# Altium project SNES TST.PrjPcb
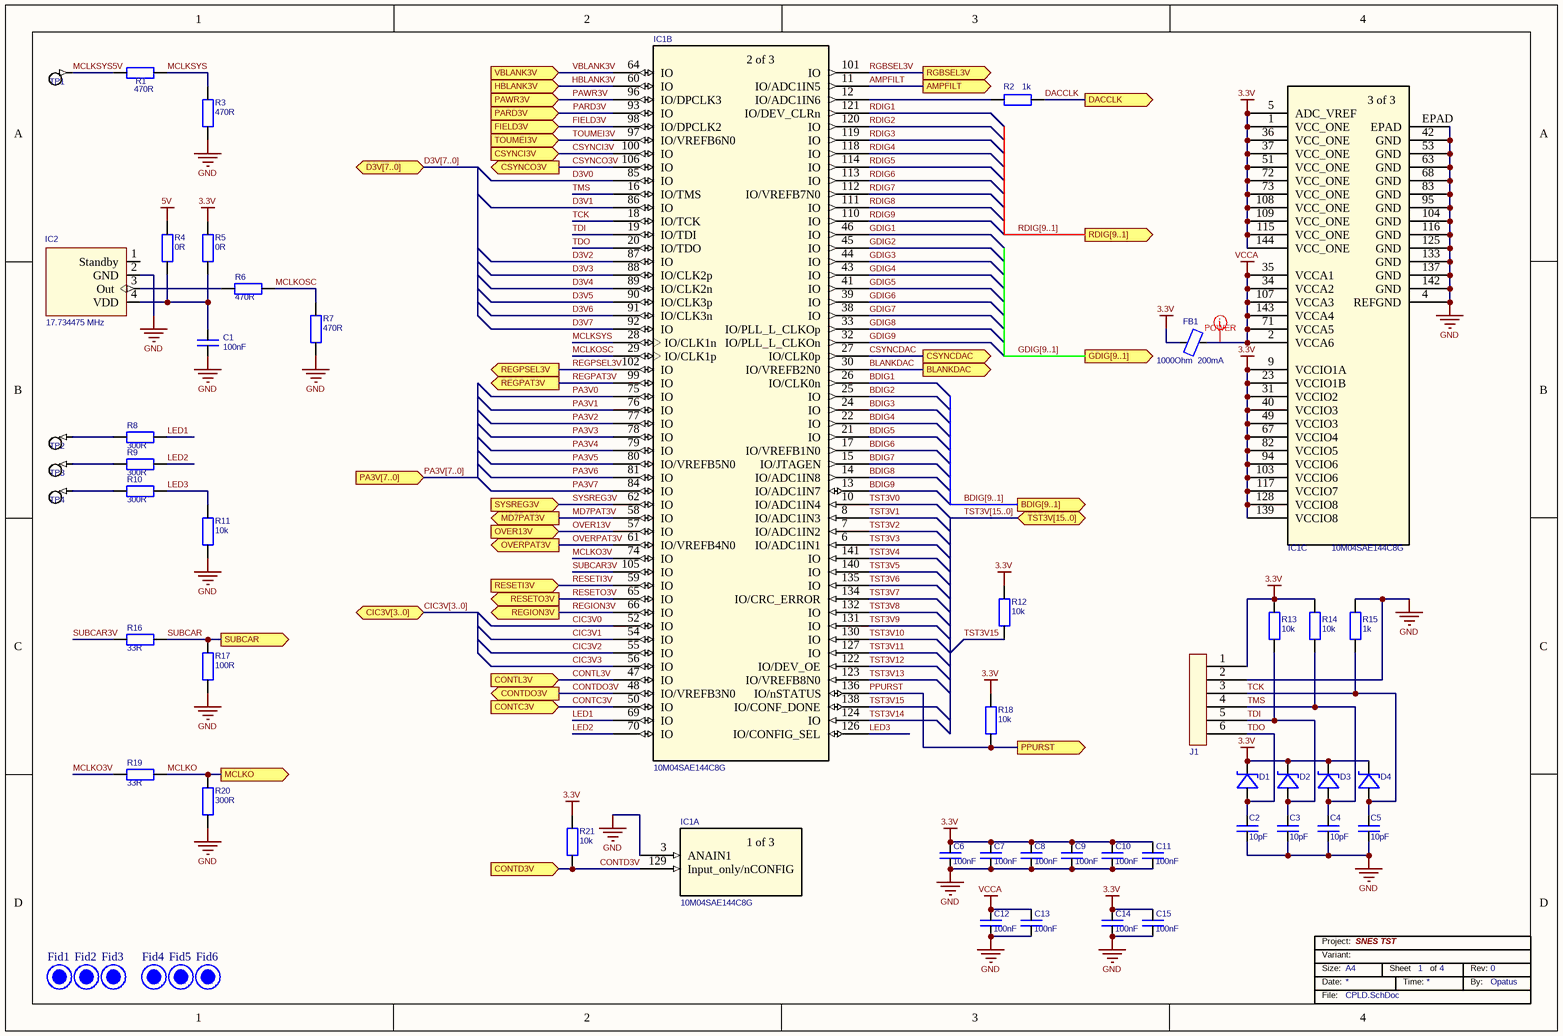
[diagram p0: CPLD.SchDoc]
Revision: Rev 0
4 sheets, 189 parts. Net scope: flat (ports and power ports of the same name join across sheets).
Board file: SNES TST.PcbDoc
Sheets:
  CPLD.SchDoc
  PPU2 And Connector.SchDoc
  Power And Voltage Shifters.SchDoc
  RGB Video Output.SchDoc

## Sheet CPLD.SchDoc: SNES TST
size A4; DrawnBy: Opatus; DocumentNumber: 1; Revision: 0; SheetNumber: 1; SheetTotal: 4

### Parts
C1  value 100nF  [Cap_0402_Chip]  (hidden comment: Ceramic Capacitor 100nF 10V ±20% X7R 0402)
C2  value 10pF  [Cap_0402_Chip]  (hidden comment: Ceramic Capacitor 10pF 10V ±20% X7R 0402)
C3  value 10pF  [Cap_0402_Chip]  (hidden comment: Ceramic Capacitor 10pF 10V ±20% X7R 0402)
C4  value 10pF  [Cap_0402_Chip]  (hidden comment: Ceramic Capacitor 10pF 10V ±20% X7R 0402)
C5  value 10pF  [Cap_0402_Chip]  (hidden comment: Ceramic Capacitor 10pF 10V ±20% X7R 0402)
C6  value 100nF  [Cap_0402_Chip]  (hidden comment: Ceramic Capacitor 100nF 10V ±20% X7R 0402)
C7  value 100nF  [Cap_0402_Chip]  (hidden comment: Ceramic Capacitor 100nF 10V ±20% X7R 0402)
C8  value 100nF  [Cap_0402_Chip]  (hidden comment: Ceramic Capacitor 100nF 10V ±20% X7R 0402)
C9  value 100nF  [Cap_0402_Chip]  (hidden comment: Ceramic Capacitor 100nF 10V ±20% X7R 0402)
C10  value 100nF  [Cap_0402_Chip]  (hidden comment: Ceramic Capacitor 100nF 10V ±20% X7R 0402)
C11  value 100nF  [Cap_0402_Chip]  (hidden comment: Ceramic Capacitor 100nF 10V ±20% X7R 0402)
C12  value 100nF  [Cap_0402_Chip]  (hidden comment: Ceramic Capacitor 100nF 10V ±20% X7R 0402)
C13  value 100nF  [Cap_0402_Chip]  (hidden comment: Ceramic Capacitor 100nF 10V ±20% X7R 0402)
C14  value 100nF  [Cap_0402_Chip]  (hidden comment: Ceramic Capacitor 100nF 10V ±20% X7R 0402)
C15  value 100nF  [Cap_0402_Chip]  (hidden comment: Ceramic Capacitor 100nF 10V ±20% X7R 0402)
D1  BAT54WS  [SOD323]  (value not drawn)
D2  BAT54WS  [SOD323]  (value not drawn)
D3  BAT54WS  [SOD323]  (value not drawn)
D4  BAT54WS  [SOD323]  (value not drawn)
FB1  1000Ohm  200mA  [Ind_0402_Chip]
Fid1  Fiducial  [Fiducial_1_side]  (value not drawn)  (no BOM)
Fid2  Fiducial  [Fiducial_1_side]  (value not drawn)  (no BOM)
Fid3  Fiducial  [Fiducial_1_side]  (value not drawn)  (no BOM)
Fid4  Fiducial  [Fiducial_1_side]  (value not drawn)  (no BOM)
Fid5  Fiducial  [Fiducial_1_side]  (value not drawn)  (no BOM)
Fid6  Fiducial  [Fiducial_1_side]  (value not drawn)  (no BOM)
IC1  10M04SAE144C8G  [EQFP-144_A:1P65_]  (parts A,B,C of 3)
IC2  17.734475 MHz  [Quarz 7.5mm]
J1  Conn 6P  [Con6P]  (value not drawn)  (no BOM)
R1  value 470R  [Res_0603_Chip]  (hidden comment: Resistor 470R 0603 ±1%)
R2  value 1k  [Res_0402_Chip]  (hidden comment: Resistor 1k 0402 ±1%)
R3  value 470R  [Res_0603_Chip]  (hidden comment: Resistor 470R 0603 ±1%)
R4  value 0R  [Res_0402_Chip]  (hidden comment: Resistor 0R 0402)
R5  value 0R  [Res_0402_Chip]  (hidden comment: Resistor 0R 0402)
R6  value 470R  [Res_0603_Chip]  (hidden comment: Resistor 470R 0603 ±1%)
R7  value 470R  [Res_0603_Chip]  (hidden comment: Resistor 470R 0603 ±1%)
R8  value 300R  [Res_0603_Chip]  (hidden comment: Resistor 300R 0603 ±1%)
R9  value 300R  [Res_0603_Chip]  (hidden comment: Resistor 300R 0603 ±1%)
R10  value 300R  [Res_0603_Chip]  (hidden comment: Resistor 300R 0603 ±1%)
R11  value 10k  [Res_0402_Chip]  (hidden comment: Resistor 10k 0402 ±1%)
R12  value 10k  [Res_0402_Chip]  (hidden comment: Resistor 10k 0402 ±1%)
R13  value 10k  [Res_0402_Chip]  (hidden comment: Resistor 10k 0402 ±1%)
R14  value 10k  [Res_0402_Chip]  (hidden comment: Resistor 10k 0402 ±1%)
R15  value 1k  [Res_0402_Chip]  (hidden comment: Resistor 1k 0402 ±1%)
R16  value 33R  [Res_0603_Chip]  (hidden comment: Resistor 33R 0603 ±1%)
R17  value 100R  [Res_0603_Chip]  (hidden comment: Resistor 100R 0603 ±1%)
R18  value 10k  [Res_0402_Chip]  (hidden comment: Resistor 10k 0402 ±1%)
R19  value 33R  [Res_0603_Chip]  (hidden comment: Resistor 33R 0603 ±1%)
R20  value 300R  [Res_0603_Chip]  (hidden comment: Resistor 300R 0603 ±1%)
R21  value 10k  [Res_0402_Chip]  (hidden comment: Resistor 10k 0402 ±1%)
TP1  Pin Connector  [Pin Connector Small]  (value not drawn)  (no BOM)
TP2  Pin Connector  [Pin Connector Small]  (value not drawn)  (no BOM)
TP3  Pin Connector  [Pin Connector Small]  (value not drawn)  (no BOM)
TP4  Pin Connector  [Pin Connector Small]  (value not drawn)  (no BOM)

### Ports
AMPFILT (out), BDIG[9..1] (out), BLANKDAC (out), CIC3V[3..0] (bidir), CONTC3V (in), CONTD3V (in), CONTDO3V (out), CONTL3V (in), CSYNCDAC (out), CSYNCI3V (in), CSYNCO3V (out), D3V[7..0] (bidir), DACCLK (out), FIELD3V (in), GDIG[9..1] (out), HBLANK3V (in), MCLKO (out), MD7PAT3V (out), OVER13V (in), OVERPAT3V (out), PA3V[7..0] (in), PARD3V (in), PAWR3V (in), PPURST (out), RDIG[9..1] (out), REGION3V (out), REGPAT3V (out), REGPSEL3V (out), RESETI3V (in), RESETO3V (out), RGBSEL3V (out), SUBCAR (out), SYSREG3V (in), TOUMEI3V (in), TST3V[15..0] (bidir), VBLANK3V (in)

### Nets
3.3V: C6.1 C7.1 C8.1 C9.1 C10.1 C11.1 C14.1 C15.1 D1.1(K) D2.1(K) D3.1(K) D4.1(K) FB1.1 IC1.1(VCC_ONE) IC1.5(ADC_VREF) IC1.9(VCCIO1A) IC1.23(VCCIO1B) IC1.31(VCCIO2) IC1.36(VCC_ONE) IC1.37(VCC_ONE) IC1.40(VCCIO3) IC1.49(VCCIO3) IC1.51(VCC_ONE) IC1.67(VCCIO4) IC1.72(VCC_ONE) IC1.73(VCC_ONE) IC1.82(VCCIO5) IC1.94(VCCIO6) IC1.103(VCCIO6) IC1.108(VCC_ONE) IC1.109(VCC_ONE) IC1.115(VCC_ONE) IC1.117(VCCIO7) IC1.128(VCCIO8) IC1.139(VCCIO8) IC1.144(VCC_ONE) J1.1 R5.1 R12.1 R13.1 R14.1 R18.1 R21.1
5V: R4.1
GND: C1.2 C2.2 C3.2 C4.2 C5.2 C6.2 C7.2 C8.2 C9.2 C10.2 C11.2 C12.2 C13.2 C14.2 C15.2 IC1.3(ANAIN1) IC1.4(REFGND) IC1.42(GND) IC1.53(GND) IC1.63(GND) IC1.68(GND) IC1.83(GND) IC1.95(GND) IC1.104(GND) IC1.116(GND) IC1.125(GND) IC1.133(GND) IC1.137(GND) IC1.142(GND) IC1.EPAD IC2.2(GND) J1.2 R3.2 R7.2 R11.1 R15.2 R17.2 R20.2
VCCA: C12.1 C13.1 FB1.2 IC1.2(VCCA6) IC1.34(VCCA2) IC1.35(VCCA1) IC1.71(VCCA5) IC1.107(VCCA3) IC1.143(VCCA4)
AMPFILT: IC1.11(IO/ADC1IN5) ; port AMPFILT
BDIG1: IC1.26(IO/CLK0n)
BDIG2: IC1.25(IO)
BDIG3: IC1.24(IO)
BDIG4: IC1.22(IO)
BDIG5: IC1.21(IO)
BDIG6: IC1.17(IO/VREFB1N0)
BDIG7: IC1.15(IO/JTAGEN)
BDIG8: IC1.14(IO/ADC1IN8)
BDIG9: IC1.13(IO/ADC1IN7)
BLANKDAC: IC1.30(IO/VREFB2N0) ; port BLANKDAC
CIC3V0: IC1.52(IO)
CIC3V1: IC1.54(IO)
CIC3V2: IC1.55(IO)
CIC3V3: IC1.56(IO)
CONTC3V: IC1.50(IO) ; port CONTC3V
CONTD3V: IC1.129(Input_only/nCONFIG) R21.2 ; port CONTD3V
CONTDO3V: IC1.48(IO/VREFB3N0) ; port CONTDO3V
CONTL3V: IC1.47(IO) ; port CONTL3V
CSYNCDAC: IC1.27(IO/CLK0p) ; port CSYNCDAC
CSYNCI3V: IC1.100(IO) ; port CSYNCI3V
CSYNCO3V: IC1.106(IO) ; port CSYNCO3V
D3V0: IC1.85(IO)
D3V1: IC1.86(IO)
D3V2: IC1.87(IO)
D3V3: IC1.88(IO/CLK2p)
D3V4: IC1.89(IO/CLK2n)
D3V5: IC1.90(IO/CLK3p)
D3V6: IC1.91(IO/CLK3n)
D3V7: IC1.92(IO)
DACCLK: R2.2 ; port DACCLK
FIELD3V: IC1.98(IO/DPCLK2) ; port FIELD3V
GDIG1: IC1.46(IO)
GDIG2: IC1.45(IO)
GDIG3: IC1.44(IO)
GDIG4: IC1.43(IO)
GDIG5: IC1.41(IO)
GDIG6: IC1.39(IO)
GDIG7: IC1.38(IO)
GDIG8: IC1.33(IO/PLL_L_CLKOp)
GDIG9: IC1.32(IO/PLL_L_CLKOn)
HBLANK3V: IC1.60(IO) ; port HBLANK3V
LED1: IC1.69(IO) R8.2
LED2: IC1.70(IO) R9.2
LED3: IC1.126(IO/CONFIG_SEL) R10.2 R11.2
MCLKO: R19.1 R20.1 ; port MCLKO
MCLKO3V: IC1.74(IO) R19.2
MCLKOSC: IC1.29(IO/CLK1p) R6.1 R7.1
MCLKSYS: IC1.28(IO/CLK1n) R1.1 R3.1
MCLKSYS5V: R1.2 TP1.1
MD7PAT3V: IC1.58(IO) ; port MD7PAT3V
OVER13V: IC1.57(IO) ; port OVER13V
OVERPAT3V: IC1.61(IO/VREFB4N0) ; port OVERPAT3V
PA3V0: IC1.75(IO)
PA3V1: IC1.76(IO)
PA3V2: IC1.77(IO)
PA3V3: IC1.78(IO)
PA3V4: IC1.79(IO)
PA3V5: IC1.80(IO/VREFB5N0)
PA3V6: IC1.81(IO)
PA3V7: IC1.84(IO)
PARD3V: IC1.93(IO) ; port PARD3V
PAWR3V: IC1.96(IO/DPCLK3) ; port PAWR3V
PPURST: IC1.136(IO/nSTATUS) R18.2 ; port PPURST
RDIG1: IC1.121(IO/DEV_CLRn)
RDIG2: IC1.120(IO)
RDIG3: IC1.119(IO)
RDIG4: IC1.118(IO)
RDIG5: IC1.114(IO)
RDIG6: IC1.113(IO)
RDIG7: IC1.112(IO/VREFB7N0)
RDIG8: IC1.111(IO)
RDIG9: IC1.110(IO)
REGION3V: IC1.66(IO) ; port REGION3V
REGPAT3V: IC1.99(IO) ; port REGPAT3V
REGPSEL3V: IC1.102(IO) ; port REGPSEL3V
RESETI3V: IC1.59(IO) ; port RESETI3V
RESETO3V: IC1.65(IO) ; port RESETO3V
RGBSEL3V: IC1.101(IO) ; port RGBSEL3V
SUBCAR: R16.1 R17.1 ; port SUBCAR
SUBCAR3V: IC1.105(IO) R16.2
SYSREG3V: IC1.62(IO) ; port SYSREG3V
TCK: C5.1 D4.2(A) IC1.18(IO/TCK) J1.3 R15.1
TDI: C3.1 D2.2(A) IC1.19(IO/TDI) J1.5 R13.2
TDO: C2.1 D1.2(A) IC1.20(IO/TDO) J1.6
TMS: C4.1 D3.2(A) IC1.16(IO/TMS) J1.4 R14.2
TOUMEI3V: IC1.97(IO/VREFB6N0) ; port TOUMEI3V
TST3V0: IC1.10(IO/ADC1IN4)
TST3V1: IC1.8(IO/ADC1IN3)
TST3V2: IC1.7(IO/ADC1IN2)
TST3V3: IC1.6(IO/ADC1IN1)
TST3V4: IC1.141(IO)
TST3V5: IC1.140(IO)
TST3V6: IC1.135(IO)
TST3V7: IC1.134(IO/CRC_ERROR)
TST3V8: IC1.132(IO)
TST3V9: IC1.131(IO)
TST3V10: IC1.130(IO)
TST3V11: IC1.127(IO)
TST3V12: IC1.122(IO/DEV_OE)
TST3V13: IC1.123(IO/VREFB8N0)
TST3V14: IC1.124(IO)
TST3V15: IC1.138(IO/CONF_DONE) R12.2
VBLANK3V: IC1.64(IO) ; port VBLANK3V
NetC1_1: C1.1 IC2.4(VDD) R4.2 R5.2
NetIC1_12: IC1.12(IO/ADC1IN6) R2.1
NetIC2_3: IC2.3(Out) R6.2
NetR8_1: R8.1 TP2.1
NetR9_1: R9.1 TP3.1
NetR10_1: R10.1 TP4.1

Not connected (* = marked no-connect by the designer): IC2 1(Standby)

### Buses and harness runs
bus BDIG[9..1] = port BDIG[9..1]
bus CIC3V[3..0] = port CIC3V[3..0]
bus D3V[7..0] = port D3V[7..0]
bus GDIG[9..1] = port GDIG[9..1]
bus PA3V[7..0] = port PA3V[7..0]
bus RDIG[9..1] = port RDIG[9..1]
bus TST3V[15..0] = port TST3V[15..0]

### Layout directives
net class POWER: VCCA

### Notes on the sheet
- Size:
- Date:
- Variant:
- Project:
- A4
- Sheet
- Time:
- of
- Rev:
- By:
- File:
- (in symbol 10M08SAE144C8G, part A) 1 of 3
- (in symbol 10M08SAE144C8G, part B) 2 of 3
- (in symbol 10M08SAE144C8G, part C) 3 of 3

### Library data of the parts
C1-C15 = Capacitor: ChipSize: 0402; NominalVoltage: 10V; Dielectric: X7R; Tolerance: ±20%; PartType: Ceramic Capacitor
D1-D4 = Schottky Diode: Manufacturer_Part_Number: BAT54WS-7-F; Vendor: Diodes
FB1 = Ferrite Bead: Manufacturer_Part_Number: MMZ1005S102CT000; Vendor: TDK; Value: 1000Ohm  200mA
IC1 = 10M08SAE144C8G: No Description Available; SourceLibrary: Intel_2020-01-10; Built_By: EMA_Cory; Vendor: Intel; Copyright: Copyright (C) 2018 Accelerated Designs. All rights reserved; Manufacturer_Part_Number: 10M04SAE144C8G; RefDes: RefDes; Type: DEV
IC2 = Oscillator: Manufacturer_Part_Number: LFSPXO020648Bulk; Vendor: IQD Frequency; Frequency: 17.734475 MHz
J1 = Conn 6P: 6 Pole Connector
R1 R3 R6-R10 R16 R17 R19 R20 = R: ChipSize: 0603; Tolerance: ±1%; PartType: Resistor
R2 R4 R5 R11-R15 R18 R21 = R: ChipSize: 0402; PartType: Resistor
  R2 R11-R15 R18 R21: Tolerance: ±1%

## Sheet PPU2 And Connector.SchDoc: SNES TST
size A4; DrawnBy: Opatus; DocumentNumber: 2; Revision: 0; SheetNumber: 2; SheetTotal: 4
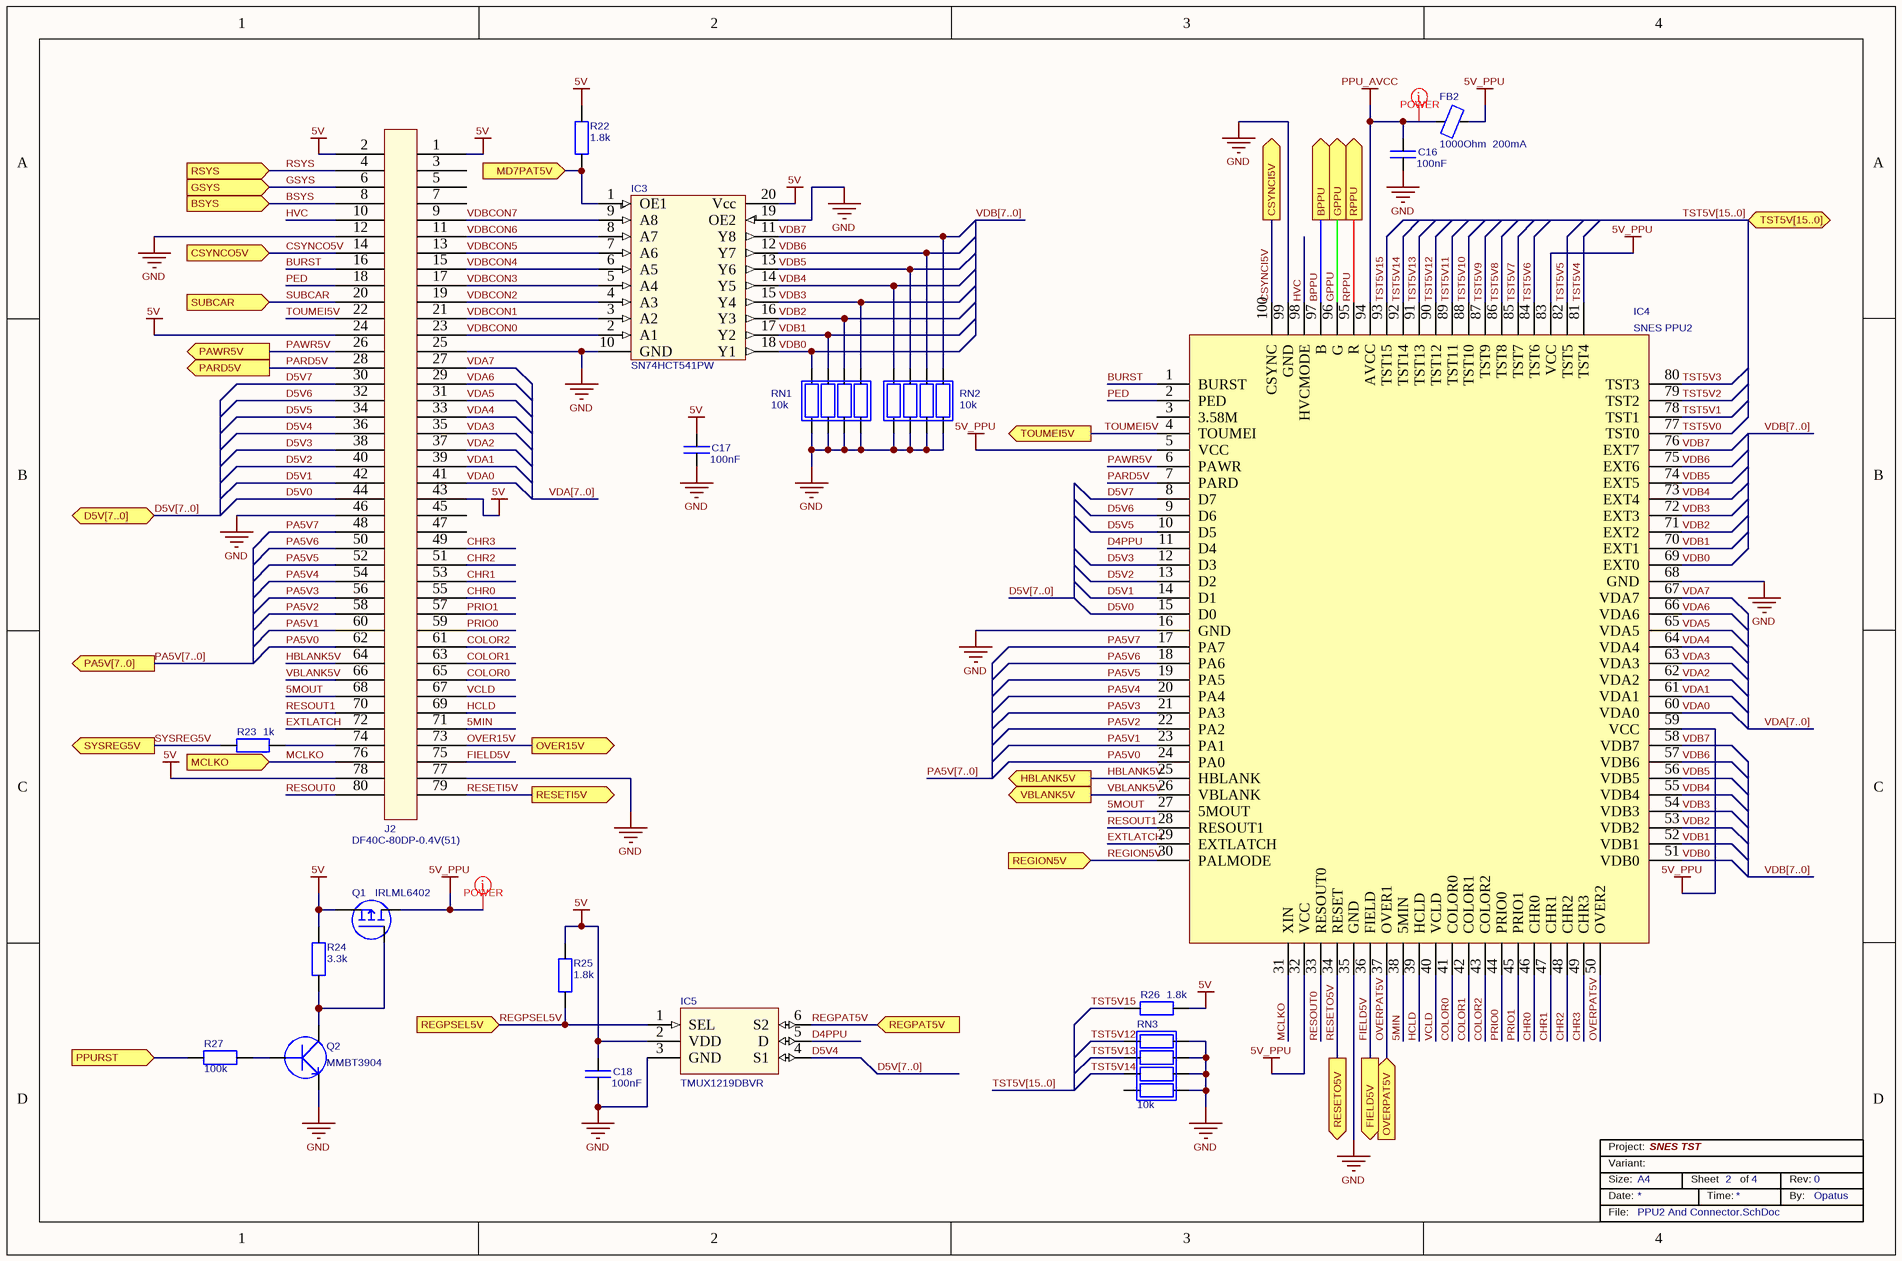
[diagram p1: PPU2 And Connector.SchDoc]

### Parts
C16  value 100nF  [Cap_0402_Chip]  (hidden comment: Ceramic Capacitor 100nF 10V ±20% X7R 0402)
C17  value 100nF  [Cap_0402_Chip]  (hidden comment: Ceramic Capacitor 100nF 10V ±20% X7R 0402)
C18  value 100nF  [Cap_0402_Chip]  (hidden comment: Ceramic Capacitor 100nF 10V ±20% X7R 0402)
FB2  1000Ohm  200mA  [Ind_0402_Chip]
IC3  Manufacturer_Part_Number: SN74HCT541PW  [TSSOP20 Narrow]  (hidden comment: SN74HCT541)
IC4  SNES PPU2  [PPU100Pin]  (no BOM)
IC5  Manufacturer_Part_Number: TMUX1219DBVR  [SOT23-6]  (hidden comment: TMUX1219)
J2  Manufacturer_Part_Number: DF40C-80DP-0.4V(51)  [DF40C-80DP]  (hidden comment: DF40C-80DP)
Q1  IRLML6402  [SOT23_FET]
Q2  MMBT3904  [SOT23_Transistor]
R22  value 1.8k  [Res_0402_Chip]  (hidden comment: Resistor 1.8k 0402 ±1%)
R23  value 1k  [Res_0402_Chip]  (hidden comment: Resistor 1k 0402 ±1%)
R24  value 3.3k  [Res_0402_Chip]  (hidden comment: Resistor 3.3k 0402 ±1%)
R25  value 1.8k  [Res_0402_Chip]  (hidden comment: Resistor 1.8k 0402 ±1%)
R26  value 1.8k  [Res_0402_Chip]  (hidden comment: Resistor 1.8k 0402 ±1%)
R27  value 100k  [Res_0402_Chip]  (hidden comment: Resistor 100k 0402 ±1%)
RN1  value 10k  [1206_Array_Chip]  (hidden comment: Resistor Network 10k 1206 ±1%)
RN2  value 10k  [1206_Array_Chip]  (hidden comment: Resistor Network 10k 1206 ±1%)
RN3  value 10k  [1206_Array_Chip]  (hidden comment: Resistor Network 10k 1206 ±1%)

### Ports
BPPU (out), BSYS (in), CSYNCI5V (out), CSYNCO5V (in), D5V[7..0] (bidir), FIELD5V (out), GPPU (out), GSYS (in), HBLANK5V (out), MCLKO (in), MD7PAT5V (in), OVER15V (out), OVERPAT5V (in), PA5V[7..0] (out), PARD5V (out), PAWR5V (out), PPURST (in), REGION5V (in), REGPAT5V (in), REGPSEL5V (in), RESETI5V (out), RESETO5V (out), RPPU (out), RSYS (in), SUBCAR (in), SYSREG5V (out), TOUMEI5V (out), TST5V[15..0] (bidir), VBLANK5V (out)

### Nets
5V: C17.1 C18.1 IC3.20(Vcc) IC5.2(VDD) J2.1 J2.2 J2.24 J2.43 J2.78 Q1.S R22.1 R24.1 R25.1 R26.1
5V_PPU: FB2.1 IC4.5(VCC) IC4.32(VCC) IC4.59(VCC) IC4.83(VCC) Q1.D
GND: C16.2 C17.2 C18.2 IC3.10(GND) IC3.19(OE2) IC4.16(GND) IC4.35(GND) IC4.68(GND) IC4.99(GND) IC5.3(GND) J2.12 J2.25 J2.46 J2.77 Q2.E RN1.1 RN1.2 RN1.3 RN1.4 RN2.1 RN2.2 RN2.3 RN2.4 RN3.1 RN3.2 RN3.3 RN3.4
PPU_AVCC: C16.1 FB2.2 IC4.94(AVCC)
5MIN: IC4.38(5MIN) J2.71
5MOUT: IC4.27(5MOUT) J2.68
BPPU: IC4.97(B) ; port BPPU
BSYS: J2.8 ; port BSYS
BURST: IC4.1(BURST) J2.16
CHR0: IC4.46(CHR0) J2.55
CHR1: IC4.47(CHR1) J2.53
CHR2: IC4.48(CHR2) J2.51
CHR3: IC4.49(CHR3) J2.49
COLOR0: IC4.41(COLOR0) J2.65
COLOR1: IC4.42(COLOR1) J2.63
COLOR2: IC4.43(COLOR2) J2.61
CSYNCI5V: IC4.100(CSYNC) ; port CSYNCI5V
CSYNCO5V: J2.14 ; port CSYNCO5V
D4PPU: IC4.11(D4) IC5.5(D)
D5V0: IC4.15(D0) J2.44
D5V1: IC4.14(D1) J2.42
D5V2: IC4.13(D2) J2.40
D5V3: IC4.12(D3) J2.38
D5V4: IC5.4(S1) J2.36
D5V5: IC4.10(D5) J2.34
D5V6: IC4.9(D6) J2.32
D5V7: IC4.8(D7) J2.30
EXTLATCH: IC4.29(EXTLATCH) J2.72
FIELD5V: IC4.36(FIELD) J2.75 ; port FIELD5V
GPPU: IC4.96(G) ; port GPPU
GSYS: J2.6 ; port GSYS
HBLANK5V: IC4.25(HBLANK) J2.64 ; port HBLANK5V
HCLD: IC4.39(HCLD) J2.69
HVC: IC4.98(HVCMODE) J2.10
MCLKO: IC4.31(XIN) J2.76 ; port MCLKO
MD7PAT5V: IC3.1(OE1) R22.2 ; port MD7PAT5V
OVER15V: J2.73 ; port OVER15V
OVERPAT5V: IC4.37(OVER1) IC4.50(OVER2) ; port OVERPAT5V
PA5V0: IC4.24(PA0) J2.62
PA5V1: IC4.23(PA1) J2.60
PA5V2: IC4.22(PA2) J2.58
PA5V3: IC4.21(PA3) J2.56
PA5V4: IC4.20(PA4) J2.54
PA5V5: IC4.19(PA5) J2.52
PA5V6: IC4.18(PA6) J2.50
PA5V7: IC4.17(PA7) J2.48
PARD5V: IC4.7(PARD) J2.28 ; port PARD5V
PAWR5V: IC4.6(PAWR) J2.26 ; port PAWR5V
PED: IC4.2(PED) J2.18
PPURST: R27.1 ; port PPURST
PRIO0: IC4.44(PRIO0) J2.59
PRIO1: IC4.45(PRIO1) J2.57
REGION5V: IC4.30(PALMODE) ; port REGION5V
REGPAT5V: IC5.6(S2) ; port REGPAT5V
REGPSEL5V: IC5.1(SEL) R25.2 ; port REGPSEL5V
RESETI5V: J2.79 ; port RESETI5V
RESETO5V: IC4.34(RESET) ; port RESETO5V
RESOUT0: IC4.33(RESOUT0) J2.80
RESOUT1: IC4.28(RESOUT1) J2.70
RPPU: IC4.95(R) ; port RPPU
RSYS: J2.4 ; port RSYS
SUBCAR: J2.20 ; port SUBCAR
SYSREG5V: R23.1 ; port SYSREG5V
TOUMEI5V: IC4.4(TOUMEI) J2.22 ; port TOUMEI5V
TST5V0: IC4.77(TST0)
TST5V1: IC4.78(TST1)
TST5V2: IC4.79(TST2)
TST5V3: IC4.80(TST3)
TST5V4: IC4.81(TST4)
TST5V5: IC4.82(TST5)
TST5V6: IC4.84(TST6)
TST5V7: IC4.85(TST7)
TST5V8: IC4.86(TST8)
TST5V9: IC4.87(TST9)
TST5V10: IC4.88(TST10)
TST5V11: IC4.89(TST11)
TST5V12: IC4.90(TST12) RN3.5
TST5V13: IC4.91(TST13) RN3.6
TST5V14: IC4.92(TST14) RN3.7
TST5V15: IC4.93(TST15) R26.2
VBLANK5V: IC4.26(VBLANK) J2.66 ; port VBLANK5V
VCLD: IC4.40(VCLD) J2.67
VDA0: IC4.60(VDA0) J2.41
VDA1: IC4.61(VDA1) J2.39
VDA2: IC4.62(VDA2) J2.37
VDA3: IC4.63(VDA3) J2.35
VDA4: IC4.64(VDA4) J2.33
VDA5: IC4.65(VDA5) J2.31
VDA6: IC4.66(VDA6) J2.29
VDA7: IC4.67(VDA7) J2.27
VDB0: IC3.18(Y1) IC4.51(VDB0) IC4.69(EXT0) RN1.8
VDB1: IC3.17(Y2) IC4.52(VDB1) IC4.70(EXT1) RN1.7
VDB2: IC3.16(Y3) IC4.53(VDB2) IC4.71(EXT2) RN1.6
VDB3: IC3.15(Y4) IC4.54(VDB3) IC4.72(EXT3) RN1.5
VDB4: IC3.14(Y5) IC4.55(VDB4) IC4.73(EXT4) RN2.8
VDB5: IC3.13(Y6) IC4.56(VDB5) IC4.74(EXT5) RN2.7
VDB6: IC3.12(Y7) IC4.57(VDB6) IC4.75(EXT6) RN2.6
VDB7: IC3.11(Y8) IC4.58(VDB7) IC4.76(EXT7) RN2.5
VDBCON0: IC3.2(A1) J2.23
VDBCON1: IC3.3(A2) J2.21
VDBCON2: IC3.4(A3) J2.19
VDBCON3: IC3.5(A4) J2.17
VDBCON4: IC3.6(A5) J2.15
VDBCON5: IC3.7(A6) J2.13
VDBCON6: IC3.8(A7) J2.11
VDBCON7: IC3.9(A8) J2.9
NetJ2_74: J2.74 R23.2
NetQ1_G: Q1.G Q2.C R24.2
NetQ2_B: Q2.B R27.2

Not connected (* = marked no-connect by the designer): IC4 3(3.58M); J2 3 5 7 45 47; RN3 8

### Buses and harness runs
bus D5V[7..0]
bus D5V[7..0] = port D5V[7..0]
bus PA5V[7..0]
bus PA5V[7..0] = port PA5V[7..0]
bus TST5V[15..0]
bus TST5V[15..0] = port TST5V[15..0]
bus VDA[7..0]
bus VDB[7..0]

### Layout directives
net class POWER: 5V_PPU, PPU_AVCC

### Notes on the sheet
- Size:
- Date:
- Variant:
- Project:
- A4
- Sheet
- Time:
- of
- Rev:
- By:
- File:

### Library data of the parts
C16-C18 = Capacitor: ChipSize: 0402; NominalVoltage: 10V; Dielectric: X7R; Tolerance: ±20%; PartType: Ceramic Capacitor
FB2 = Ferrite Bead: as FB1 on sheet CPLD; Value: 1000Ohm  200mA
IC3 = SN74HCT541: Vendor: Texas Instruments
IC4 = PPU2100Pin: PPU2; Vendor: Nintendo; Manufacturer_Part_Number: PPU2
IC5 = TMUX1219: 2:1 MUX; Vendor: Texas Instruments
J2 = Conn 80P: 80Pole Connector; Vendor: Hirose Connector
Q1 = Mosfet1: Vendor: Diodes; Manufacturer_Part_Number: IRLML6402
Q2 = T_NPN: Vendor: Diodes; Manufacturer_Part_Number: MMBT3904
R22-R27 = R: ChipSize: 0402; Tolerance: ±1%; PartType: Resistor
RN1-RN3 = RNetwork: ChipSize: 1206; Tolerance: ±1%; PartType: Resistor Network

## Sheet Power And Voltage Shifters.SchDoc: SNES TST
size A4; DrawnBy: Opatus; DocumentNumber: 3; Revision: 0; SheetNumber: 3; SheetTotal: 4
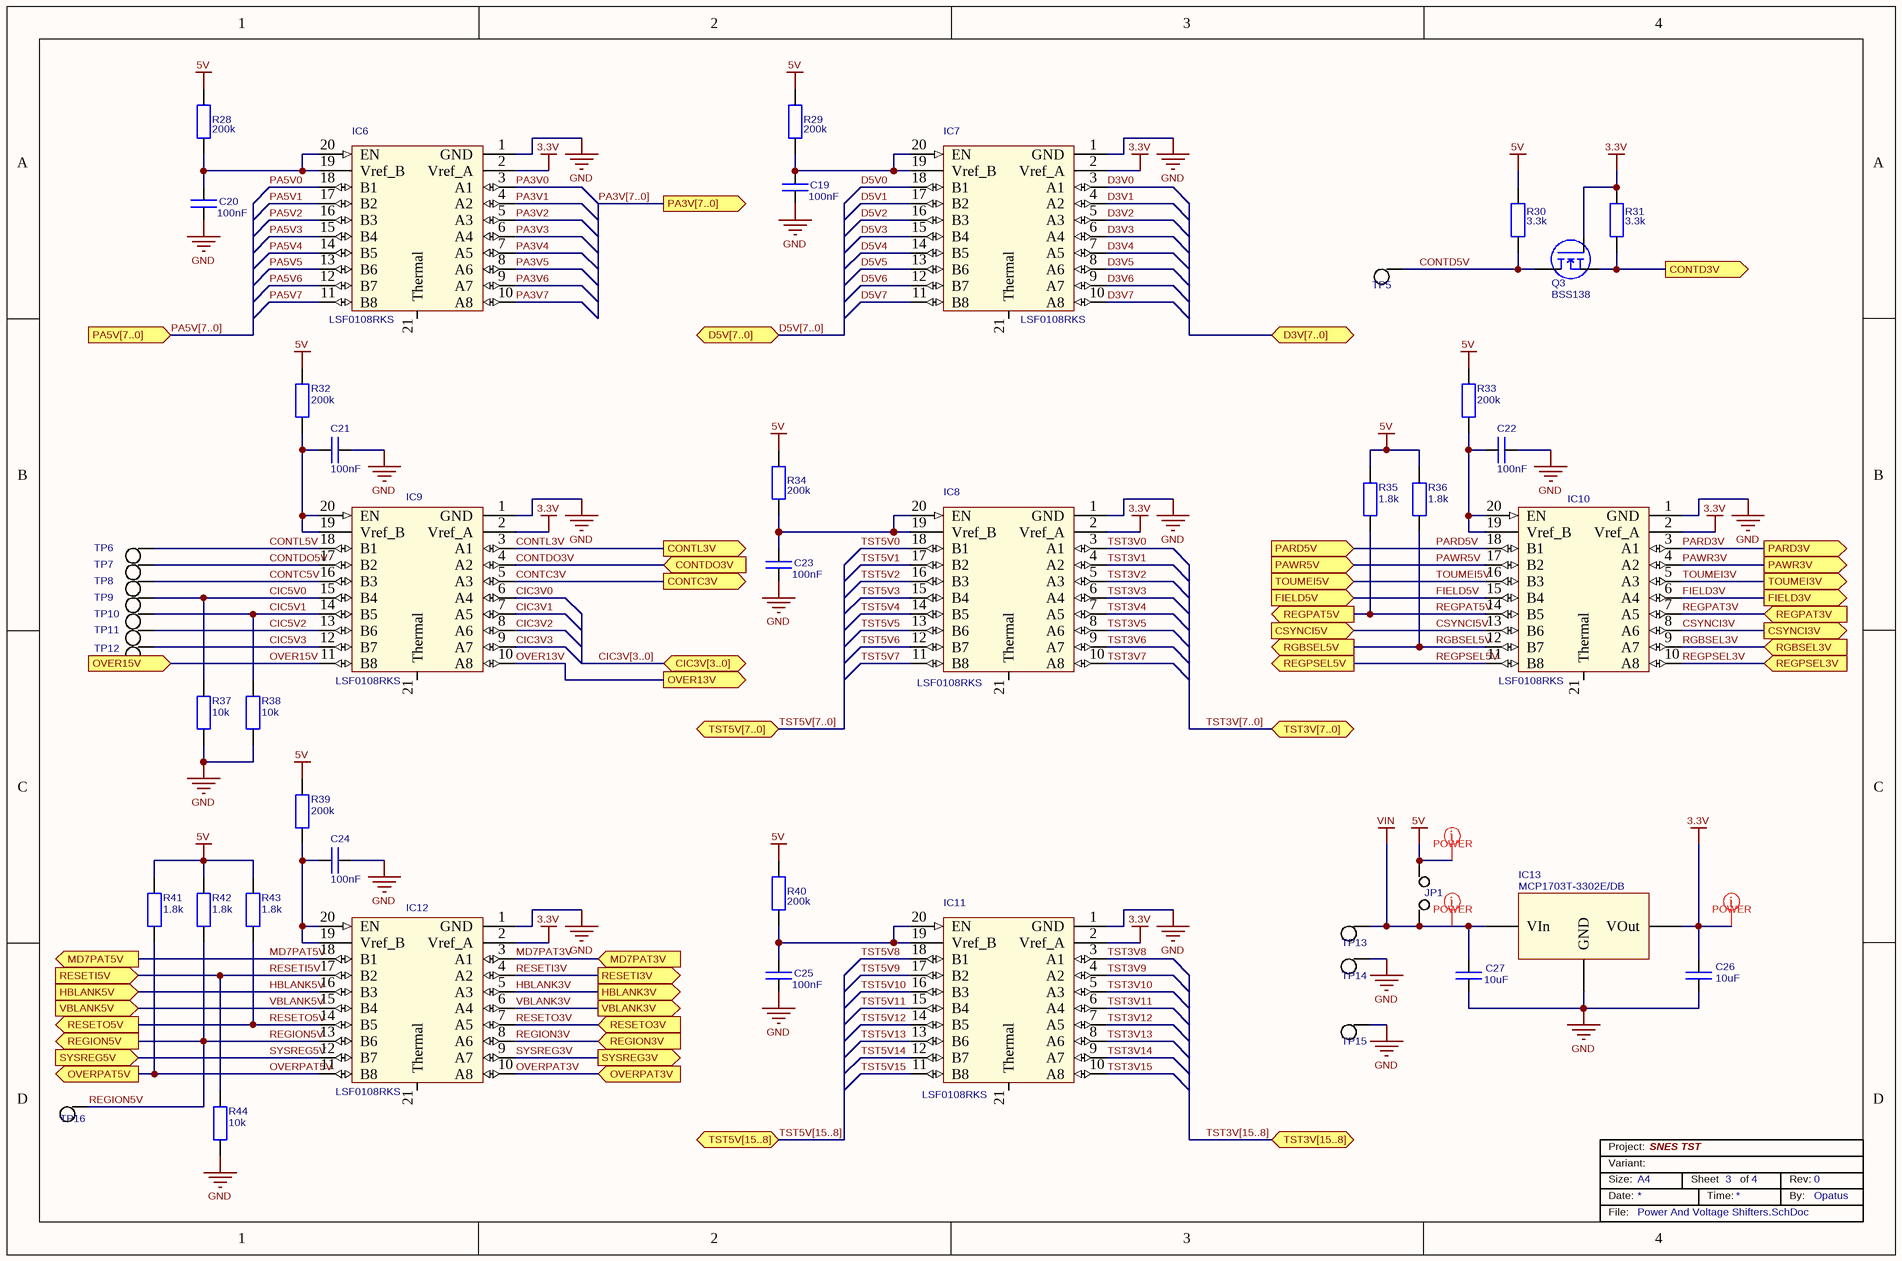
[diagram p2: Power And Voltage Shifters.SchDoc]

### Parts
C19  value 100nF  [Cap_0402_Chip]  (hidden comment: Ceramic Capacitor 100nF 10V ±20% X7R 0402)
C20  value 100nF  [Cap_0402_Chip]  (hidden comment: Ceramic Capacitor 100nF 10V ±20% X7R 0402)
C21  value 100nF  [Cap_0402_Chip]  (hidden comment: Ceramic Capacitor 100nF 10V ±20% X7R 0402)
C22  value 100nF  [Cap_0402_Chip]  (hidden comment: Ceramic Capacitor 100nF 10V ±20% X7R 0402)
C23  value 100nF  [Cap_0402_Chip]  (hidden comment: Ceramic Capacitor 100nF 10V ±20% X7R 0402)
C24  value 100nF  [Cap_0402_Chip]  (hidden comment: Ceramic Capacitor 100nF 10V ±20% X7R 0402)
C25  value 100nF  [Cap_0402_Chip]  (hidden comment: Ceramic Capacitor 100nF 10V ±20% X7R 0402)
C26  value 10uF  [Cap_0805_Chip]  (hidden comment: Ceramic Capacitor 10uF 10V ±20% X7R 0805)
C27  value 10uF  [Cap_1206_Chip]  (hidden comment: Ceramic Capacitor 10uF 25V ±20% X7R 1206)
IC6  Manufacturer_Part_Number: LSF0108RKS  [VQFN20]  (hidden comment: LSF0108)
IC7  Manufacturer_Part_Number: LSF0108RKS  [VQFN20]  (hidden comment: LSF0108)
IC8  Manufacturer_Part_Number: LSF0108RKS  [VQFN20]  (hidden comment: LSF0108)
IC9  Manufacturer_Part_Number: LSF0108RKS  [VQFN20]  (hidden comment: LSF0108)
IC10  Manufacturer_Part_Number: LSF0108RKS  [VQFN20]  (hidden comment: LSF0108)
IC11  Manufacturer_Part_Number: LSF0108RKS  [VQFN20]  (hidden comment: LSF0108)
IC12  Manufacturer_Part_Number: LSF0108RKS  [VQFN20]  (hidden comment: LSF0108)
IC13  Manufacturer_Part_Number: MCP1703T-3302E/DB  [SOT223-3]  (hidden comment: MCP1703T)
JP1  Jumper  [Jumper Big]  (value not drawn)  (no BOM)
Q3  BSS138  [SOT23_FET]
R28  value 200k  [Res_0402_Chip]  (hidden comment: Resistor 200k 0402 ±1%)
R29  value 200k  [Res_0402_Chip]  (hidden comment: Resistor 200k 0402 ±1%)
R30  value 3.3k  [Res_0402_Chip]  (hidden comment: Resistor 3.3k 0402 ±1%)
R31  value 3.3k  [Res_0402_Chip]  (hidden comment: Resistor 3.3k 0402 ±1%)
R32  value 200k  [Res_0402_Chip]  (hidden comment: Resistor 200k 0402 ±1%)
R33  value 200k  [Res_0402_Chip]  (hidden comment: Resistor 200k 0402 ±1%)
R34  value 200k  [Res_0402_Chip]  (hidden comment: Resistor 200k 0402 ±1%)
R35  value 1.8k  [Res_0402_Chip]  (hidden comment: Resistor 1.8k 0402 ±1%)
R36  value 1.8k  [Res_0402_Chip]  (hidden comment: Resistor 1.8k 0402 ±1%)
R37  value 10k  [Res_0402_Chip]  (hidden comment: Resistor 10k 0402 ±1%)
R38  value 10k  [Res_0402_Chip]  (hidden comment: Resistor 10k 0402 ±1%)
R39  value 200k  [Res_0402_Chip]  (hidden comment: Resistor 200k 0402 ±1%)
R40  value 200k  [Res_0402_Chip]  (hidden comment: Resistor 200k 0402 ±1%)
R41  value 1.8k  [Res_0402_Chip]  (hidden comment: Resistor 1.8k 0402 ±1%)
R42  value 1.8k  [Res_0402_Chip]  (hidden comment: Resistor 1.8k 0402 ±1%)
R43  value 1.8k  [Res_0402_Chip]  (hidden comment: Resistor 1.8k 0402 ±1%)
R44  value 10k  [Res_0402_Chip]  (hidden comment: Resistor 10k 0402 ±1%)
TP5  Pin Connector  [Pin Connector Small]  (value not drawn)  (no BOM)
TP6  Pin Connector  [Pin Connector Small]  (value not drawn)  (no BOM)
TP7  Pin Connector  [Pin Connector Small]  (value not drawn)  (no BOM)
TP8  Pin Connector  [Pin Connector Small]  (value not drawn)  (no BOM)
TP9  Pin Connector  [Pin Connector Small]  (value not drawn)  (no BOM)
TP10  Pin Connector  [Pin Connector Small]  (value not drawn)  (no BOM)
TP11  Pin Connector  [Pin Connector Small]  (value not drawn)  (no BOM)
TP12  Pin Connector  [Pin Connector Small]  (value not drawn)  (no BOM)
TP13  Pin Connector  [Pin Connector Small]  (value not drawn)  (no BOM)
TP14  Pin Connector  [Pin Connector Small]  (value not drawn)  (no BOM)
TP15  Pin Connector  [Pin Connector Small]  (value not drawn)  (no BOM)
TP16  Pin Connector  [Pin Connector Small]  (value not drawn)  (no BOM)

### Ports
CIC3V[3..0] (bidir), CONTC3V (out), CONTD3V (out), CONTDO3V (in), CONTL3V (out), CSYNCI3V (out), CSYNCI5V (in), D3V[7..0] (bidir), D5V[7..0] (bidir), FIELD3V (out), FIELD5V (in), HBLANK3V (out), HBLANK5V (in), MD7PAT3V (in), MD7PAT5V (out), OVER13V (out), OVER15V (in), OVERPAT3V (in), OVERPAT5V (out), PA3V[7..0] (out), PA5V[7..0] (in), PARD3V (out), PARD5V (in), PAWR3V (out), PAWR5V (in), REGION3V (in), REGION5V (out), REGPAT3V (in), REGPAT5V (out), REGPSEL3V (in), REGPSEL5V (out), RESETI3V (out), RESETI5V (in), RESETO3V (in), RESETO5V (out), RGBSEL3V (in), RGBSEL5V (out), SYSREG3V (out), SYSREG5V (in), TOUMEI3V (out), TOUMEI5V (in), TST3V[7..0] (bidir), TST3V[15..8] (bidir), TST5V[7..0] (bidir), TST5V[15..8] (bidir), VBLANK3V (out), VBLANK5V (in)

### Nets
3.3V: C26.2 IC6.2(Vref_A) IC7.2(Vref_A) IC8.2(Vref_A) IC9.2(Vref_A) IC10.2(Vref_A) IC11.2(Vref_A) IC12.2(Vref_A) IC13.3(VOut) Q3.G R31.2
5V: JP1.1 R28.2 R29.2 R30.2 R32.1 R33.1 R34.2 R35.1 R36.1 R39.2 R40.2 R41.1 R42.1 R43.1
GND: C19.2 C20.2 C21.1 C22.1 C23.2 C24.2 C25.2 C26.1 C27.1 IC6.1(GND) IC7.1(GND) IC8.1(GND) IC9.1(GND) IC10.1(GND) IC11.1(GND) IC12.1(GND) IC13.2(GND) R37.1 R38.1 R44.2 TP14.1 TP15.1
VIN: C27.2 IC13.1(VIn) JP1.2 TP13.1
CIC3V0: IC9.6(A4)
CIC3V1: IC9.7(A5)
CIC3V2: IC9.8(A6)
CIC3V3: IC9.9(A7)
CIC5V0: IC9.15(B4) R37.2 TP9.1
CIC5V1: IC9.14(B5) R38.2 TP10.1
CIC5V2: IC9.13(B6) TP11.1
CIC5V3: IC9.12(B7) TP12.1
CONTC3V: IC9.5(A3) ; port CONTC3V
CONTC5V: IC9.16(B3) TP8.1
CONTD3V: Q3.S R31.1 ; port CONTD3V
CONTD5V: Q3.D R30.1 TP5.1
CONTDO3V: IC9.4(A2) ; port CONTDO3V
CONTDO5V: IC9.17(B2) TP7.1
CONTL3V: IC9.3(A1) ; port CONTL3V
CONTL5V: IC9.18(B1) TP6.1
CSYNCI3V: IC10.8(A6) ; port CSYNCI3V
CSYNCI5V: IC10.13(B6) ; port CSYNCI5V
D3V0: IC7.3(A1)
D3V1: IC7.4(A2)
D3V2: IC7.5(A3)
D3V3: IC7.6(A4)
D3V4: IC7.7(A5)
D3V5: IC7.8(A6)
D3V6: IC7.9(A7)
D3V7: IC7.10(A8)
D5V0: IC7.18(B1)
D5V1: IC7.17(B2)
D5V2: IC7.16(B3)
D5V3: IC7.15(B4)
D5V4: IC7.14(B5)
D5V5: IC7.13(B6)
D5V6: IC7.12(B7)
D5V7: IC7.11(B8)
FIELD3V: IC10.6(A4) ; port FIELD3V
FIELD5V: IC10.15(B4) ; port FIELD5V
HBLANK3V: IC12.5(A3) ; port HBLANK3V
HBLANK5V: IC12.16(B3) ; port HBLANK5V
MD7PAT3V: IC12.3(A1) ; port MD7PAT3V
MD7PAT5V: IC12.18(B1) ; port MD7PAT5V
OVER13V: IC9.10(A8) ; port OVER13V
OVER15V: IC9.11(B8) ; port OVER15V
OVERPAT3V: IC12.10(A8) ; port OVERPAT3V
OVERPAT5V: IC12.11(B8) R41.2 ; port OVERPAT5V
PA3V0: IC6.3(A1)
PA3V1: IC6.4(A2)
PA3V2: IC6.5(A3)
PA3V3: IC6.6(A4)
PA3V4: IC6.7(A5)
PA3V5: IC6.8(A6)
PA3V6: IC6.9(A7)
PA3V7: IC6.10(A8)
PA5V0: IC6.18(B1)
PA5V1: IC6.17(B2)
PA5V2: IC6.16(B3)
PA5V3: IC6.15(B4)
PA5V4: IC6.14(B5)
PA5V5: IC6.13(B6)
PA5V6: IC6.12(B7)
PA5V7: IC6.11(B8)
PARD3V: IC10.3(A1) ; port PARD3V
PARD5V: IC10.18(B1) ; port PARD5V
PAWR3V: IC10.4(A2) ; port PAWR3V
PAWR5V: IC10.17(B2) ; port PAWR5V
REGION3V: IC12.8(A6) ; port REGION3V
REGION5V: IC12.13(B6) R42.2 TP16.1 ; port REGION5V
REGPAT3V: IC10.7(A5) ; port REGPAT3V
REGPAT5V: IC10.14(B5) R35.2 ; port REGPAT5V
REGPSEL3V: IC10.10(A8) ; port REGPSEL3V
REGPSEL5V: IC10.11(B8) ; port REGPSEL5V
RESETI3V: IC12.4(A2) ; port RESETI3V
RESETI5V: IC12.17(B2) R44.1 ; port RESETI5V
RESETO3V: IC12.7(A5) ; port RESETO3V
RESETO5V: IC12.14(B5) R43.2 ; port RESETO5V
RGBSEL3V: IC10.9(A7) ; port RGBSEL3V
RGBSEL5V: IC10.12(B7) R36.2 ; port RGBSEL5V
SYSREG3V: IC12.9(A7) ; port SYSREG3V
SYSREG5V: IC12.12(B7) ; port SYSREG5V
TOUMEI3V: IC10.5(A3) ; port TOUMEI3V
TOUMEI5V: IC10.16(B3) ; port TOUMEI5V
TST3V0: IC8.3(A1)
TST3V1: IC8.4(A2)
TST3V2: IC8.5(A3)
TST3V3: IC8.6(A4)
TST3V4: IC8.7(A5)
TST3V5: IC8.8(A6)
TST3V6: IC8.9(A7)
TST3V7: IC8.10(A8)
TST3V8: IC11.3(A1)
TST3V9: IC11.4(A2)
TST3V10: IC11.5(A3)
TST3V11: IC11.6(A4)
TST3V12: IC11.7(A5)
TST3V13: IC11.8(A6)
TST3V14: IC11.9(A7)
TST3V15: IC11.10(A8)
TST5V0: IC8.18(B1)
TST5V1: IC8.17(B2)
TST5V2: IC8.16(B3)
TST5V3: IC8.15(B4)
TST5V4: IC8.14(B5)
TST5V5: IC8.13(B6)
TST5V6: IC8.12(B7)
TST5V7: IC8.11(B8)
TST5V8: IC11.18(B1)
TST5V9: IC11.17(B2)
TST5V10: IC11.16(B3)
TST5V11: IC11.15(B4)
TST5V12: IC11.14(B5)
TST5V13: IC11.13(B6)
TST5V14: IC11.12(B7)
TST5V15: IC11.11(B8)
VBLANK3V: IC12.6(A4) ; port VBLANK3V
VBLANK5V: IC12.15(B4) ; port VBLANK5V
NetC19_1: C19.1 IC7.19(Vref_B) IC7.20(EN) R29.1
NetC20_1: C20.1 IC6.19(Vref_B) IC6.20(EN) R28.1
NetC21_2: C21.2 IC9.19(Vref_B) IC9.20(EN) R32.2
NetC22_2: C22.2 IC10.19(Vref_B) IC10.20(EN) R33.2
NetC23_1: C23.1 IC8.19(Vref_B) IC8.20(EN) R34.1
NetC24_1: C24.1 IC12.19(Vref_B) IC12.20(EN) R39.1
NetC25_1: C25.1 IC11.19(Vref_B) IC11.20(EN) R40.1

Not connected (* = marked no-connect by the designer): IC6 21(Thermal); IC7 21(Thermal); IC8 21(Thermal); IC9 21(Thermal); IC10 21(Thermal); IC11 21(Thermal); IC12 21(Thermal)

### Buses and harness runs
bus CIC3V[3..0] = port CIC3V[3..0]
bus D5V[7..0] = port D5V[7..0]
bus PA3V[7..0] = port PA3V[7..0]
bus PA5V[7..0] = port PA5V[7..0]
bus TST3V[7..0] = port TST3V[7..0]
bus TST3V[15..8] = port TST3V[15..8]
bus TST5V[7..0] = port TST5V[7..0]
bus TST5V[15..8] = port TST5V[15..8]

### Layout directives
net class POWER: 3.3V, 5V, VIN

### Notes on the sheet
- Size:
- Date:
- Variant:
- Project:
- A4
- Sheet
- Time:
- of
- Rev:
- By:
- File:

### Library data of the parts
C19-C25 = Capacitor: ChipSize: 0402; NominalVoltage: 10V; Dielectric: X7R; Tolerance: ±20%; PartType: Ceramic Capacitor
C26 = Capacitor: ChipSize: 0805; NominalVoltage: 10V; Dielectric: X7R; Tolerance: ±20%; PartType: Ceramic Capacitor
C27 = Capacitor: ChipSize: 1206; NominalVoltage: 25V; Dielectric: X7R; Tolerance: ±20%; PartType: Ceramic Capacitor
IC6-IC12 = LSF0108DCUR: 8-bit level shifter; Vendor: Texas Instruments
IC13 = MCP1703 SOT223: 3.3V Regulator; Vendor: Microchip
Q3 = Mosfet N: Vendor: Infenion; Manufacturer_Part_Number: BSS138
R28-R44 = R: ChipSize: 0402; Tolerance: ±1%; PartType: Resistor

## Sheet RGB Video Output.SchDoc: SNES TST
size A4; DrawnBy: Opatus; DocumentNumber: 4; Revision: 0; SheetNumber: 4; SheetTotal: 4
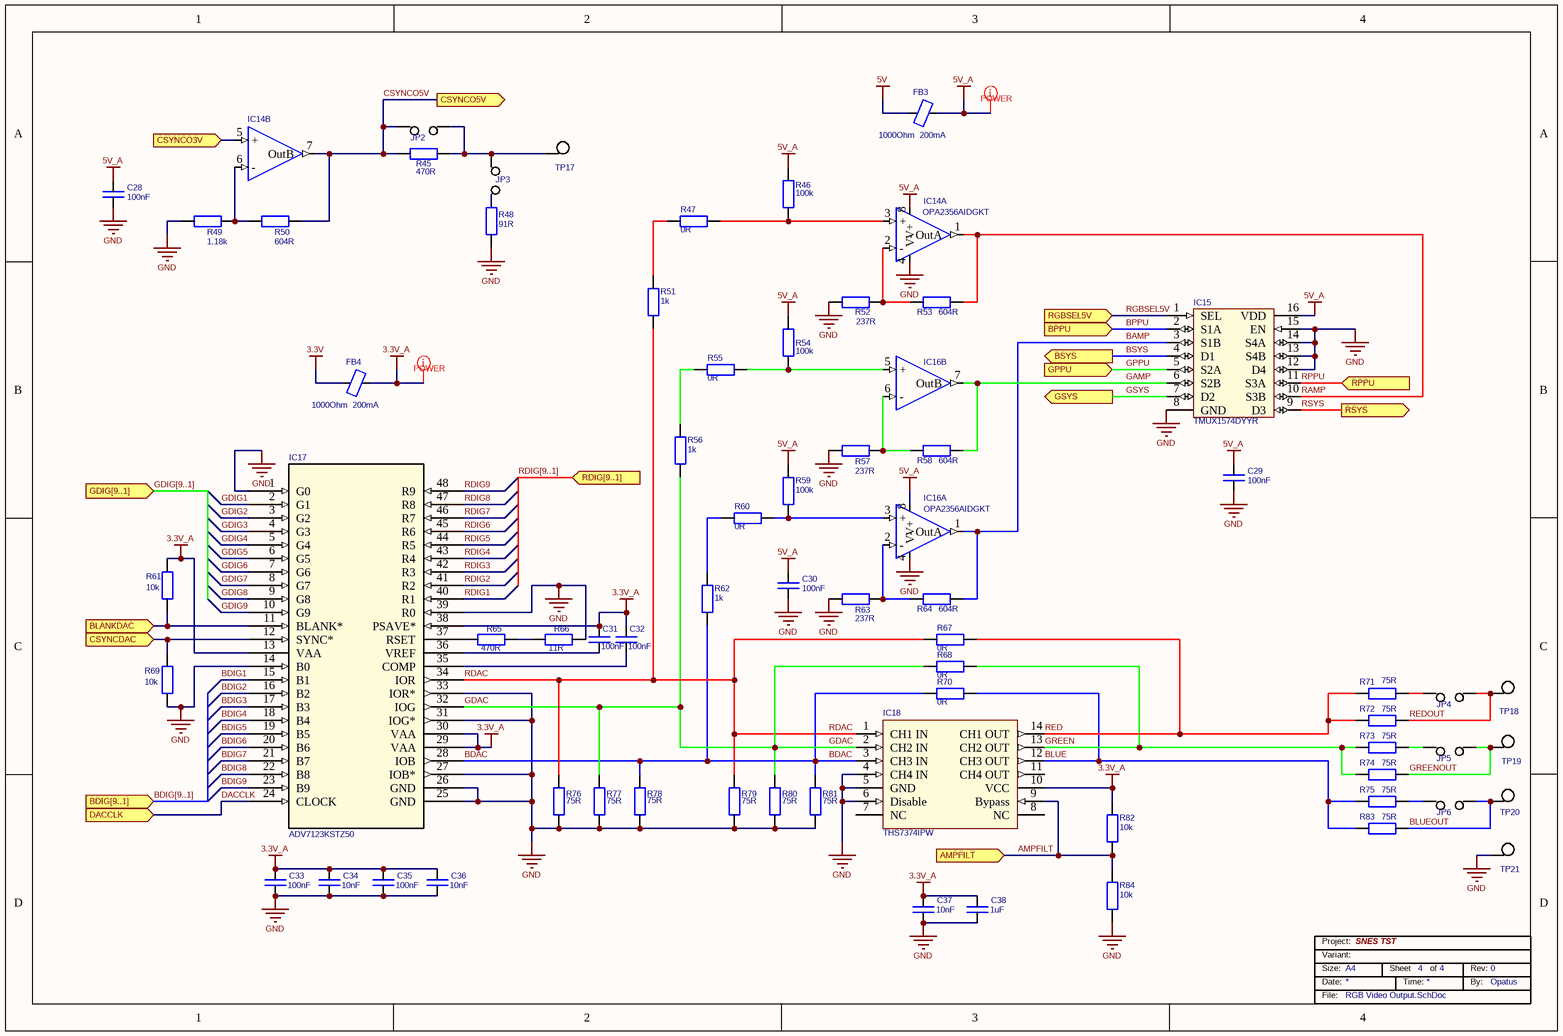
[diagram p3: RGB Video Output.SchDoc]

### Parts
C28  value 100nF  [Cap_0402_Chip]  (hidden comment: Ceramic Capacitor 100nF 10V ±20% X7R 0402)
C29  value 100nF  [Cap_0402_Chip]  (hidden comment: Ceramic Capacitor 100nF 10V ±20% X7R 0402)
C30  value 100nF  [Cap_0402_Chip]  (hidden comment: Ceramic Capacitor 100nF 10V ±20% X7R 0402)
C31  value 100nF  [Cap_0402_Chip]  (hidden comment: Ceramic Capacitor 100nF 10V ±20% X7R 0402)
C32  value 100nF  [Cap_0402_Chip]  (hidden comment: Ceramic Capacitor 100nF 10V ±20% X7R 0402)
C33  value 100nF  [Cap_0402_Chip]  (hidden comment: Ceramic Capacitor 100nF 10V ±20% X7R 0402)
C34  value 10nF  [Cap_0402_Chip]  (hidden comment: Ceramic Capacitor 10nF 10V ±20% X7R 0402)
C35  value 100nF  [Cap_0402_Chip]  (hidden comment: Ceramic Capacitor 100nF 10V ±20% X7R 0402)
C36  value 10nF  [Cap_0402_Chip]  (hidden comment: Ceramic Capacitor 10nF 10V ±20% X7R 0402)
C37  value 10nF  [Cap_0402_Chip]  (hidden comment: Ceramic Capacitor 10nF 10V ±20% X7R 0402)
C38  value 1uF  [Cap_0603_Chip]  (hidden comment: Ceramic Capacitor 1uF 10V ±20% X7R 0603)
FB3  1000Ohm  200mA  [Ind_0402_Chip]
FB4  1000Ohm  200mA  [Ind_0402_Chip]
IC14  Manufacturer_Part_Number: OPA2356AIDGKT  [MSOP8]  (hidden comment: OPA2356)  (parts A,B of 2)
IC15  Manufacturer_Part_Number: TMUX1574DYYR  [SOT-23THIN16]  (hidden comment: TMUX1574)
IC16  Manufacturer_Part_Number: OPA2356AIDGKT  [MSOP8]  (hidden comment: OPA2356)  (parts A,B of 2)
IC17  Manufacturer_Part_Number: ADV7123KSTZ50  [ST_48_ADI]  (hidden comment: ADV7123)
IC18  Manufacturer_Part_Number: THS7374IPW  [TSSOP14]  (hidden comment: THS7374)
JP2  Jumper  [Jumper]  (value not drawn)  (no BOM)
JP3  Jumper  [Jumper]  (value not drawn)  (no BOM)
JP4  Jumper  [Jumper]  (value not drawn)  (no BOM)
JP5  Jumper  [Jumper]  (value not drawn)  (no BOM)
JP6  Jumper  [Jumper]  (value not drawn)  (no BOM)
R45  value 470R  [Res_0603_Chip]  (hidden comment: Resistor 470R 0603 ±1%)
R46  value 100k  [Res_0402_Chip]  (hidden comment: Resistor 100k 0402 ±1%)
R47  value 0R  [Res_0402_Chip]  (hidden comment: Resistor 0R 0402)
R48  value 91R  [Res_0603_Chip]  (hidden comment: Resistor 91R 0603 ±1%)
R49  value 1.18k  [Res_0402_Chip]  (hidden comment: Resistor 1.18k 0402 ±1%)
R50  value 604R  [Res_0402_Chip]  (hidden comment: Resistor 604R 0402 ±1%)
R51  value 1k  [Res_0402_Chip]  (hidden comment: Resistor 1k 0402 ±1%)
R52  value 237R  [Res_0402_Chip]  (hidden comment: Resistor 237R 0402 ±1%)
R53  value 604R  [Res_0402_Chip]  (hidden comment: Resistor 604R 0402 ±1%)
R54  value 100k  [Res_0402_Chip]  (hidden comment: Resistor 100k 0402 ±1%)
R55  value 0R  [Res_0402_Chip]  (hidden comment: Resistor 0R 0402)
R56  value 1k  [Res_0402_Chip]  (hidden comment: Resistor 1k 0402 ±1%)
R57  value 237R  [Res_0402_Chip]  (hidden comment: Resistor 237R 0402 ±1%)
R58  value 604R  [Res_0402_Chip]  (hidden comment: Resistor 604R 0402 ±1%)
R59  value 100k  [Res_0402_Chip]  (hidden comment: Resistor 100k 0402 ±1%)
R60  value 0R  [Res_0402_Chip]  (hidden comment: Resistor 0R 0402)
R61  value 10k  [Res_0402_Chip]  (hidden comment: Resistor 10k 0402 ±1%)
R62  value 1k  [Res_0402_Chip]  (hidden comment: Resistor 1k 0402 ±1%)
R63  value 237R  [Res_0402_Chip]  (hidden comment: Resistor 237R 0402 ±1%)
R64  value 604R  [Res_0402_Chip]  (hidden comment: Resistor 604R 0402 ±1%)
R65  value 470R  [Res_0402_Chip]  (hidden comment: Resistor 470R 0402 ±1%)
R66  value 11R  [Res_0402_Chip]  (hidden comment: Resistor 11R 0402 ±1%)
R67  value 0R  [Res_0402_Chip]  (hidden comment: Resistor 0R 0402)
R68  value 0R  [Res_0402_Chip]  (hidden comment: Resistor 0R 0402)
R69  value 10k  [Res_0402_Chip]  (hidden comment: Resistor 10k 0402 ±1%)
R70  value 0R  [Res_0402_Chip]  (hidden comment: Resistor 0R 0402)
R71  value 75R  [Res_0603_Chip]  (hidden comment: Resistor 75R 0603 ±1%)
R72  value 75R  [Res_0603_Chip]  (hidden comment: Resistor 75R 0603 ±1%)
R73  value 75R  [Res_0603_Chip]  (hidden comment: Resistor 75R 0603 ±1%)
R74  value 75R  [Res_0603_Chip]  (hidden comment: Resistor 75R 0603 ±1%)
R75  value 75R  [Res_0603_Chip]  (hidden comment: Resistor 75R 0603 ±1%)
R76  value 75R  [Res_0402_Chip]  (hidden comment: Resistor 75R 0402 ±1%)
R77  value 75R  [Res_0402_Chip]  (hidden comment: Resistor 75R 0402 ±1%)
R78  value 75R  [Res_0402_Chip]  (hidden comment: Resistor 75R 0402 ±1%)
R79  value 75R  [Res_0402_Chip]  (hidden comment: Resistor 75R 0402 ±1%)
R80  value 75R  [Res_0402_Chip]  (hidden comment: Resistor 75R 0402 ±1%)
R81  value 75R  [Res_0402_Chip]  (hidden comment: Resistor 75R 0402 ±1%)
R82  value 10k  [Res_0402_Chip]  (hidden comment: Resistor 10k 0402 ±1%)
R83  value 75R  [Res_0603_Chip]  (hidden comment: Resistor 75R 0603 ±1%)
R84  value 10k  [Res_0402_Chip]  (hidden comment: Resistor 10k 0402 ±1%)
TP17  Pin Connector  [Pin Connector Small]  (value not drawn)  (no BOM)
TP18  Pin Connector  [Pin Connector Small]  (value not drawn)  (no BOM)
TP19  Pin Connector  [Pin Connector Small]  (value not drawn)  (no BOM)
TP20  Pin Connector  [Pin Connector Small]  (value not drawn)  (no BOM)
TP21  Pin Connector  [Pin Connector Small]  (value not drawn)  (no BOM)

### Ports
AMPFILT (in), BDIG[9..1] (in), BLANKDAC (in), BPPU (in), BSYS (out), CSYNCDAC (in), CSYNCO3V (in), CSYNCO5V (out), DACCLK (in), GDIG[9..1] (in), GPPU (in), GSYS (out), RDIG[9..1] (in), RGBSEL5V (in), RPPU (in), RSYS (out)

### Nets
3.3V: FB4.1
3.3V_A: C31.1 C32.1 C33.2 C34.2 C35.2 C36.2 C37.2 C38.2 FB4.2 IC17.13(VAA) IC17.29(VAA) IC17.30(VAA) IC17.38(PSAVE*) IC18.10(VCC) R61.2 R82.1
5V: FB3.1
5V_A: C28.1 C29.1 C30.1 FB3.2 IC14.8(V+) IC15.16(VDD) IC16.8(V+) R46.2 R54.2 R59.2
GND: C28.2 C29.2 C30.2 C33.1 C34.1 C35.1 C36.1 C37.1 C38.1 IC14.4(V-) IC15.8(GND) IC15.12(D4) IC15.13(S4B) IC15.14(S4A) IC15.15(EN) IC16.4(V-) IC17.1(G0) IC17.14(B0) IC17.25(GND) IC17.26(GND) IC17.27(IOB*) IC17.31(IOG*) IC17.33(IOR*) IC17.39(R0) IC18.4(CH4_IN) IC18.5(GND) IC18.6(Disable) R48.1 R49.1 R52.1 R57.1 R63.2 R66.2 R69.1 R76.1 R77.1 R78.1 R79.1 R80.1 R81.1 R84.2 TP21.1
AMPFILT: IC18.9(Bypass) R82.2 R84.1 ; port AMPFILT
BAMP: IC15.3(S1B) IC16.1(OutA) R64.2
BDAC: IC17.28(IOB) IC18.3(CH3_IN) R62.2 R70.2 R78.2 R81.2
BDIG1: IC17.15(B1)
BDIG2: IC17.16(B2)
BDIG3: IC17.17(B3)
BDIG4: IC17.18(B4)
BDIG5: IC17.19(B5)
BDIG6: IC17.20(B6)
BDIG7: IC17.21(B7)
BDIG8: IC17.22(B8)
BDIG9: IC17.23(B9)
BLANKDAC: IC17.11(BLANK*) R61.1 ; port BLANKDAC
BLUE: IC18.12(CH3_OUT) R70.1 R75.1 R83.1
BLUEOUT: JP6.1 R83.2 TP20.1
BPPU: IC15.2(S1A) ; port BPPU
BSYS: IC15.4(D1) ; port BSYS
CSYNCDAC: IC17.12(SYNC*) R69.2 ; port CSYNCDAC
CSYNCO3V: IC14.5(+) ; port CSYNCO3V
CSYNCO5V: IC14.7(OutB) JP2.2 R45.1 R50.1 ; port CSYNCO5V
DACCLK: IC17.24(CLOCK) ; port DACCLK
GAMP: IC15.6(S2B) IC16.7(OutB) R58.1
GDAC: IC17.32(IOG) IC18.2(CH2_IN) R56.2 R68.2 R77.2 R80.2
GDIG1: IC17.2(G1)
GDIG2: IC17.3(G2)
GDIG3: IC17.4(G3)
GDIG4: IC17.5(G4)
GDIG5: IC17.6(G5)
GDIG6: IC17.7(G6)
GDIG7: IC17.8(G7)
GDIG8: IC17.9(G8)
GDIG9: IC17.10(G9)
GPPU: IC15.5(S2A) ; port GPPU
GREEN: IC18.13(CH2_OUT) R68.1 R73.1 R74.1
GREENOUT: JP5.1 R74.2 TP19.1
GSYS: IC15.7(D2) ; port GSYS
RAMP: IC14.1(OutA) IC15.10(S3B) R53.2
RDAC: IC17.34(IOR) IC18.1(CH1_IN) R51.2 R67.2 R76.2 R79.2
RDIG1: IC17.40(R1)
RDIG2: IC17.41(R2)
RDIG3: IC17.42(R3)
RDIG4: IC17.43(R4)
RDIG5: IC17.44(R5)
RDIG6: IC17.45(R6)
RDIG7: IC17.46(R7)
RDIG8: IC17.47(R8)
RDIG9: IC17.48(R9)
RED: IC18.14(CH1_OUT) R67.1 R71.1 R72.1
REDOUT: JP4.1 R72.2 TP18.1
RGBSEL5V: IC15.1(SEL) ; port RGBSEL5V
RPPU: IC15.11(S3A) ; port RPPU
RSYS: IC15.9(D3) ; port RSYS
NetC31_2: C31.2 IC17.36(VREF)
NetC32_2: C32.2 IC17.35(COMP)
NetIC14_2: IC14.2(-) R52.2 R53.1
NetIC14_3: IC14.3(+) R46.1 R47.1
NetIC14_6: IC14.6(-) R49.2 R50.2
NetIC16_2: IC16.2(-) R63.1 R64.1
NetIC16_3: IC16.3(+) R59.1 R60.1
NetIC16_5: IC16.5(+) R54.1 R55.1
NetIC16_6: IC16.6(-) R57.2 R58.2
NetIC17_37: IC17.37(RSET) R65.1
NetJP2_1: JP2.1 JP3.1 R45.2 TP17.1
NetJP3_2: JP3.2 R48.2
NetJP4_2: JP4.2 R71.2
NetJP5_2: JP5.2 R73.2
NetJP6_2: JP6.2 R75.2
NetR47_2: R47.2 R51.1
NetR55_2: R55.2 R56.1
NetR60_2: R60.2 R62.1
NetR65_2: R65.2 R66.1

Not connected (* = marked no-connect by the designer): IC18 7(NC) 8(NC) 11(CH4_OUT)

### Buses and harness runs
bus BDIG[9..1] = port BDIG[9..1]
bus GDIG[9..1] = port GDIG[9..1]
bus RDIG[9..1] = port RDIG[9..1]

### Layout directives
net class POWER: 3.3V_A, 5V_A

### Notes on the sheet
- Size:
- Date:
- Variant:
- Project:
- A4
- Sheet
- Time:
- of
- Rev:
- By:
- File:

### Library data of the parts
C28-C37 = Capacitor: ChipSize: 0402; NominalVoltage: 10V; Dielectric: X7R; Tolerance: ±20%; PartType: Ceramic Capacitor
C38 = Capacitor: ChipSize: 0603; NominalVoltage: 10V; Dielectric: X7R; Tolerance: ±20%; PartType: Ceramic Capacitor
FB3 FB4 = Ferrite Bead: as FB1 on sheet CPLD; Value: 1000Ohm  200mA
IC14 IC16 = OPA2356: Vendor: Analog Devices
IC15 = TMUX1574: SPDT 4 Ch; Vendor: Texas Instruments
IC17 = ADV7123KSTZ140: 10Bit Video DAC; Vendor: Analog Devices Inc; Built_By: EMA_UL_Team; SourceLibrary: Analog_2012-01-01_8; Copyright: Copyright (C) 2018 Accelerated Designs. All rights reserved; RefDes: RefDes; Type: DEV
IC18 = THS7374: Vendor: Texas Instruments
R45 R48 R71-R75 R83 = R: ChipSize: 0603; Tolerance: ±1%; PartType: Resistor
R46 R47 R49-R70 R76-R82 R84 = R: ChipSize: 0402; PartType: Resistor
  R46 R49-R54 R56-R59 R61-R66 R69 R76-R82 R84: Tolerance: ±1%

## Nets that join several sheets
3.3V: CPLD (43 pins), Power And Voltage Shifters (11 pins), RGB Video Output (FB4.1)
5V: CPLD (R4.1), PPU2 And Connector (14 pins), Power And Voltage Shifters (14 pins), RGB Video Output (FB3.1)
GND: CPLD (38 pins), PPU2 And Connector (27 pins), Power And Voltage Shifters (22 pins), RGB Video Output (42 pins)
AMPFILT: CPLD (IC1.11), RGB Video Output (IC18.9 R82.2 R84.1)
BDIG1: CPLD (IC1.26), RGB Video Output (IC17.15)
BDIG2: CPLD (IC1.25), RGB Video Output (IC17.16)
BDIG3: CPLD (IC1.24), RGB Video Output (IC17.17)
BDIG4: CPLD (IC1.22), RGB Video Output (IC17.18)
BDIG5: CPLD (IC1.21), RGB Video Output (IC17.19)
BDIG6: CPLD (IC1.17), RGB Video Output (IC17.20)
BDIG7: CPLD (IC1.15), RGB Video Output (IC17.21)
BDIG8: CPLD (IC1.14), RGB Video Output (IC17.22)
BDIG9: CPLD (IC1.13), RGB Video Output (IC17.23)
BLANKDAC: CPLD (IC1.30), RGB Video Output (IC17.11 R61.1)
BPPU: PPU2 And Connector (IC4.97), RGB Video Output (IC15.2)
BSYS: PPU2 And Connector (J2.8), RGB Video Output (IC15.4)
CIC3V0: CPLD (IC1.52), Power And Voltage Shifters (IC9.6)
CIC3V1: CPLD (IC1.54), Power And Voltage Shifters (IC9.7)
CIC3V2: CPLD (IC1.55), Power And Voltage Shifters (IC9.8)
CIC3V3: CPLD (IC1.56), Power And Voltage Shifters (IC9.9)
CONTC3V: CPLD (IC1.50), Power And Voltage Shifters (IC9.5)
CONTD3V: CPLD (IC1.129 R21.2), Power And Voltage Shifters (Q3.S R31.1)
CONTDO3V: CPLD (IC1.48), Power And Voltage Shifters (IC9.4)
CONTL3V: CPLD (IC1.47), Power And Voltage Shifters (IC9.3)
CSYNCDAC: CPLD (IC1.27), RGB Video Output (IC17.12 R69.2)
CSYNCI3V: CPLD (IC1.100), Power And Voltage Shifters (IC10.8)
CSYNCI5V: PPU2 And Connector (IC4.100), Power And Voltage Shifters (IC10.13)
CSYNCO3V: CPLD (IC1.106), RGB Video Output (IC14.5)
CSYNCO5V: PPU2 And Connector (J2.14), RGB Video Output (IC14.7 JP2.2 R45.1 R50.1)
D5V0: PPU2 And Connector (IC4.15 J2.44), Power And Voltage Shifters (IC7.18)
D5V1: PPU2 And Connector (IC4.14 J2.42), Power And Voltage Shifters (IC7.17)
D5V2: PPU2 And Connector (IC4.13 J2.40), Power And Voltage Shifters (IC7.16)
D5V3: PPU2 And Connector (IC4.12 J2.38), Power And Voltage Shifters (IC7.15)
D5V4: PPU2 And Connector (IC5.4 J2.36), Power And Voltage Shifters (IC7.14)
D5V5: PPU2 And Connector (IC4.10 J2.34), Power And Voltage Shifters (IC7.13)
D5V6: PPU2 And Connector (IC4.9 J2.32), Power And Voltage Shifters (IC7.12)
D5V7: PPU2 And Connector (IC4.8 J2.30), Power And Voltage Shifters (IC7.11)
DACCLK: CPLD (R2.2), RGB Video Output (IC17.24)
FIELD3V: CPLD (IC1.98), Power And Voltage Shifters (IC10.6)
FIELD5V: PPU2 And Connector (IC4.36 J2.75), Power And Voltage Shifters (IC10.15)
GDIG1: CPLD (IC1.46), RGB Video Output (IC17.2)
GDIG2: CPLD (IC1.45), RGB Video Output (IC17.3)
GDIG3: CPLD (IC1.44), RGB Video Output (IC17.4)
GDIG4: CPLD (IC1.43), RGB Video Output (IC17.5)
GDIG5: CPLD (IC1.41), RGB Video Output (IC17.6)
GDIG6: CPLD (IC1.39), RGB Video Output (IC17.7)
GDIG7: CPLD (IC1.38), RGB Video Output (IC17.8)
GDIG8: CPLD (IC1.33), RGB Video Output (IC17.9)
GDIG9: CPLD (IC1.32), RGB Video Output (IC17.10)
GPPU: PPU2 And Connector (IC4.96), RGB Video Output (IC15.5)
GSYS: PPU2 And Connector (J2.6), RGB Video Output (IC15.7)
HBLANK3V: CPLD (IC1.60), Power And Voltage Shifters (IC12.5)
HBLANK5V: PPU2 And Connector (IC4.25 J2.64), Power And Voltage Shifters (IC12.16)
MCLKO: CPLD (R19.1 R20.1), PPU2 And Connector (IC4.31 J2.76)
MD7PAT3V: CPLD (IC1.58), Power And Voltage Shifters (IC12.3)
MD7PAT5V: PPU2 And Connector (IC3.1 R22.2), Power And Voltage Shifters (IC12.18)
OVER13V: CPLD (IC1.57), Power And Voltage Shifters (IC9.10)
OVER15V: PPU2 And Connector (J2.73), Power And Voltage Shifters (IC9.11)
OVERPAT3V: CPLD (IC1.61), Power And Voltage Shifters (IC12.10)
OVERPAT5V: PPU2 And Connector (IC4.37 IC4.50), Power And Voltage Shifters (IC12.11 R41.2)
PA3V0: CPLD (IC1.75), Power And Voltage Shifters (IC6.3)
PA3V1: CPLD (IC1.76), Power And Voltage Shifters (IC6.4)
PA3V2: CPLD (IC1.77), Power And Voltage Shifters (IC6.5)
PA3V3: CPLD (IC1.78), Power And Voltage Shifters (IC6.6)
PA3V4: CPLD (IC1.79), Power And Voltage Shifters (IC6.7)
PA3V5: CPLD (IC1.80), Power And Voltage Shifters (IC6.8)
PA3V6: CPLD (IC1.81), Power And Voltage Shifters (IC6.9)
PA3V7: CPLD (IC1.84), Power And Voltage Shifters (IC6.10)
PA5V0: PPU2 And Connector (IC4.24 J2.62), Power And Voltage Shifters (IC6.18)
PA5V1: PPU2 And Connector (IC4.23 J2.60), Power And Voltage Shifters (IC6.17)
PA5V2: PPU2 And Connector (IC4.22 J2.58), Power And Voltage Shifters (IC6.16)
PA5V3: PPU2 And Connector (IC4.21 J2.56), Power And Voltage Shifters (IC6.15)
PA5V4: PPU2 And Connector (IC4.20 J2.54), Power And Voltage Shifters (IC6.14)
PA5V5: PPU2 And Connector (IC4.19 J2.52), Power And Voltage Shifters (IC6.13)
PA5V6: PPU2 And Connector (IC4.18 J2.50), Power And Voltage Shifters (IC6.12)
PA5V7: PPU2 And Connector (IC4.17 J2.48), Power And Voltage Shifters (IC6.11)
PARD3V: CPLD (IC1.93), Power And Voltage Shifters (IC10.3)
PARD5V: PPU2 And Connector (IC4.7 J2.28), Power And Voltage Shifters (IC10.18)
PAWR3V: CPLD (IC1.96), Power And Voltage Shifters (IC10.4)
PAWR5V: PPU2 And Connector (IC4.6 J2.26), Power And Voltage Shifters (IC10.17)
PPURST: CPLD (IC1.136 R18.2), PPU2 And Connector (R27.1)
RDIG1: CPLD (IC1.121), RGB Video Output (IC17.40)
RDIG2: CPLD (IC1.120), RGB Video Output (IC17.41)
RDIG3: CPLD (IC1.119), RGB Video Output (IC17.42)
RDIG4: CPLD (IC1.118), RGB Video Output (IC17.43)
RDIG5: CPLD (IC1.114), RGB Video Output (IC17.44)
RDIG6: CPLD (IC1.113), RGB Video Output (IC17.45)
RDIG7: CPLD (IC1.112), RGB Video Output (IC17.46)
RDIG8: CPLD (IC1.111), RGB Video Output (IC17.47)
RDIG9: CPLD (IC1.110), RGB Video Output (IC17.48)
REGION3V: CPLD (IC1.66), Power And Voltage Shifters (IC12.8)
REGION5V: PPU2 And Connector (IC4.30), Power And Voltage Shifters (IC12.13 R42.2 TP16.1)
REGPAT3V: CPLD (IC1.99), Power And Voltage Shifters (IC10.7)
REGPAT5V: PPU2 And Connector (IC5.6), Power And Voltage Shifters (IC10.14 R35.2)
REGPSEL3V: CPLD (IC1.102), Power And Voltage Shifters (IC10.10)
REGPSEL5V: PPU2 And Connector (IC5.1 R25.2), Power And Voltage Shifters (IC10.11)
RESETI3V: CPLD (IC1.59), Power And Voltage Shifters (IC12.4)
RESETI5V: PPU2 And Connector (J2.79), Power And Voltage Shifters (IC12.17 R44.1)
RESETO3V: CPLD (IC1.65), Power And Voltage Shifters (IC12.7)
RESETO5V: PPU2 And Connector (IC4.34), Power And Voltage Shifters (IC12.14 R43.2)
RGBSEL3V: CPLD (IC1.101), Power And Voltage Shifters (IC10.9)
RGBSEL5V: Power And Voltage Shifters (IC10.12 R36.2), RGB Video Output (IC15.1)
RPPU: PPU2 And Connector (IC4.95), RGB Video Output (IC15.11)
RSYS: PPU2 And Connector (J2.4), RGB Video Output (IC15.9)
SUBCAR: CPLD (R16.1 R17.1), PPU2 And Connector (J2.20)
SYSREG3V: CPLD (IC1.62), Power And Voltage Shifters (IC12.9)
SYSREG5V: PPU2 And Connector (R23.1), Power And Voltage Shifters (IC12.12)
TOUMEI3V: CPLD (IC1.97), Power And Voltage Shifters (IC10.5)
TOUMEI5V: PPU2 And Connector (IC4.4 J2.22), Power And Voltage Shifters (IC10.16)
VBLANK3V: CPLD (IC1.64), Power And Voltage Shifters (IC12.6)
VBLANK5V: PPU2 And Connector (IC4.26 J2.66), Power And Voltage Shifters (IC12.15)

## Assembly variants
NTSC System: not fitted C34 C35 IC17 R10 R67 R69 R71 R75 R76 R77 R78
PAL System: not fitted R9 R63 R64 R66 R67 R69 R71 R80